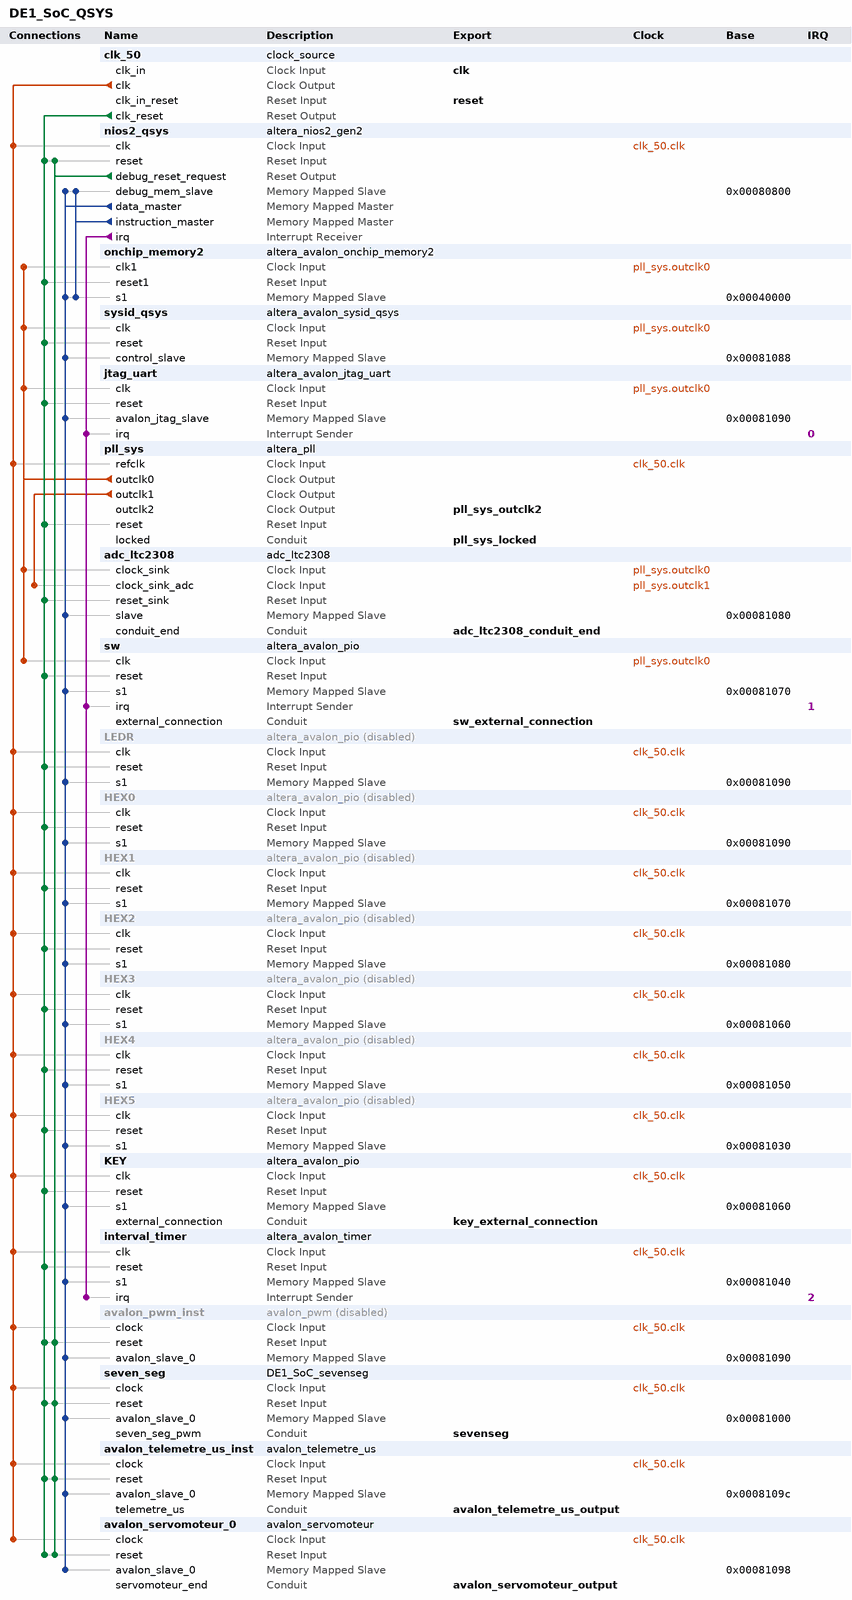
[diagram p0: system contents]
# Platform Designer (Qsys) system DE1_SoC_QSYS, Cyclone V 5CSEMA5F31C6
# Parameters at their usual value, and those the tool derives, are not listed.
package require -exact qsys 18.1
create_system DE1_SoC_QSYS
set_project_property DEVICE_FAMILY {Cyclone V}
set_project_property DEVICE 5CSEMA5F31C6

add_instance clk_50 clock_source 18.1
set_instance_parameter_value clk_50 clockFrequency 50000000

add_instance nios2_qsys altera_nios2_gen2 18.1
set_instance_parameter_value nios2_qsys dcache_size 2048
set_instance_parameter_value nios2_qsys exceptionSlave onchip_memory2.s1
set_instance_parameter_value nios2_qsys icache_size 4096
set_instance_parameter_value nios2_qsys impl Fast
set_instance_parameter_value nios2_qsys resetSlave onchip_memory2.s1
set_instance_parameter_value nios2_qsys setting_activateTrace true

add_instance onchip_memory2 altera_avalon_onchip_memory2 18.1
set_instance_parameter_value onchip_memory2 dataWidth 32
set_instance_parameter_value onchip_memory2 dualPort false
set_instance_parameter_value onchip_memory2 initMemContent true
set_instance_parameter_value onchip_memory2 initializationFileName onchip_mem.hex
set_instance_parameter_value onchip_memory2 memorySize 160000

add_instance sysid_qsys altera_avalon_sysid_qsys 18.1
set_instance_parameter_value sysid_qsys id 0

add_instance jtag_uart altera_avalon_jtag_uart 18.1
set_instance_parameter_value jtag_uart simInteractiveOptions NO_INTERACTIVE_WINDOWS

add_instance pll_sys altera_pll 18.1
set_instance_parameter_value pll_sys gui_device_speed_grade 2
set_instance_parameter_value pll_sys gui_number_of_clocks 3
set_instance_parameter_value pll_sys gui_operation_mode normal
set_instance_parameter_value pll_sys gui_output_clock_frequency0 100.0
set_instance_parameter_value pll_sys gui_output_clock_frequency1 40.0
set_instance_parameter_value pll_sys gui_output_clock_frequency2 200.0
set_instance_parameter_value pll_sys gui_pll_mode {Integer-N PLL}
set_instance_parameter_value pll_sys gui_reference_clock_frequency 50.0
set_instance_parameter_value pll_sys gui_use_locked true

add_instance adc_ltc2308 adc_ltc2308 1.1

add_instance sw altera_avalon_pio 18.1
set_instance_parameter_value sw captureEdge true
set_instance_parameter_value sw direction Input
set_instance_parameter_value sw edgeType ANY
set_instance_parameter_value sw generateIRQ true
set_instance_parameter_value sw irqType EDGE
set_instance_parameter_value sw width 10

add_instance LEDR altera_avalon_pio 18.1
set_instance_property LEDR ENABLED false
set_instance_parameter_value LEDR direction Output
set_instance_parameter_value LEDR width 10

add_instance HEX0 altera_avalon_pio 18.1
set_instance_property HEX0 ENABLED false
set_instance_parameter_value HEX0 direction Output
set_instance_parameter_value HEX0 width 7

add_instance HEX1 altera_avalon_pio 18.1
set_instance_property HEX1 ENABLED false
set_instance_parameter_value HEX1 direction Output
set_instance_parameter_value HEX1 width 7

add_instance HEX2 altera_avalon_pio 18.1
set_instance_property HEX2 ENABLED false
set_instance_parameter_value HEX2 direction Output
set_instance_parameter_value HEX2 width 7

add_instance HEX3 altera_avalon_pio 18.1
set_instance_property HEX3 ENABLED false
set_instance_parameter_value HEX3 direction Output
set_instance_parameter_value HEX3 width 7

add_instance HEX4 altera_avalon_pio 18.1
set_instance_property HEX4 ENABLED false
set_instance_parameter_value HEX4 direction Output
set_instance_parameter_value HEX4 width 7

add_instance HEX5 altera_avalon_pio 18.1
set_instance_property HEX5 ENABLED false
set_instance_parameter_value HEX5 direction Output
set_instance_parameter_value HEX5 width 7

add_instance KEY altera_avalon_pio 18.1
set_instance_parameter_value KEY direction Input
set_instance_parameter_value KEY width 4

add_instance interval_timer altera_avalon_timer 18.1
set_instance_parameter_value interval_timer period 1
set_instance_parameter_value interval_timer periodUnits MSEC

add_instance avalon_pwm_inst avalon_pwm 1.0
set_instance_property avalon_pwm_inst ENABLED false

add_instance seven_seg DE1_SoC_sevenseg 1.0

add_instance avalon_telemetre_us_inst avalon_telemetre_us 1.0

add_instance avalon_servomoteur_0 avalon_servomoteur 1.0

# connections
add_connection clk_50.clk avalon_pwm_inst.clock clock
add_connection clk_50.clk avalon_servomoteur_0.clock clock
add_connection clk_50.clk avalon_telemetre_us_inst.clock clock
add_connection clk_50.clk HEX0.clk clock
add_connection clk_50.clk HEX1.clk clock
add_connection clk_50.clk HEX2.clk clock
add_connection clk_50.clk HEX3.clk clock
add_connection clk_50.clk HEX4.clk clock
add_connection clk_50.clk HEX5.clk clock
add_connection clk_50.clk interval_timer.clk clock
add_connection clk_50.clk KEY.clk clock
add_connection clk_50.clk LEDR.clk clock
add_connection clk_50.clk nios2_qsys.clk clock
add_connection clk_50.clk pll_sys.refclk clock
add_connection clk_50.clk seven_seg.clock clock
add_connection pll_sys.outclk0 adc_ltc2308.clock_sink clock
add_connection pll_sys.outclk0 jtag_uart.clk clock
add_connection pll_sys.outclk0 onchip_memory2.clk1 clock
add_connection pll_sys.outclk0 sw.clk clock
add_connection pll_sys.outclk0 sysid_qsys.clk clock
add_connection pll_sys.outclk1 adc_ltc2308.clock_sink_adc clock
add_connection clk_50.clk_reset adc_ltc2308.reset_sink reset
add_connection clk_50.clk_reset avalon_pwm_inst.reset reset
add_connection clk_50.clk_reset avalon_servomoteur_0.reset reset
add_connection clk_50.clk_reset avalon_telemetre_us_inst.reset reset
add_connection clk_50.clk_reset HEX0.reset reset
add_connection clk_50.clk_reset HEX1.reset reset
add_connection clk_50.clk_reset HEX2.reset reset
add_connection clk_50.clk_reset HEX3.reset reset
add_connection clk_50.clk_reset HEX4.reset reset
add_connection clk_50.clk_reset HEX5.reset reset
add_connection clk_50.clk_reset interval_timer.reset reset
add_connection clk_50.clk_reset jtag_uart.reset reset
add_connection clk_50.clk_reset KEY.reset reset
add_connection clk_50.clk_reset LEDR.reset reset
add_connection clk_50.clk_reset nios2_qsys.reset reset
add_connection clk_50.clk_reset onchip_memory2.reset1 reset
add_connection clk_50.clk_reset pll_sys.reset reset
add_connection clk_50.clk_reset seven_seg.reset reset
add_connection clk_50.clk_reset sw.reset reset
add_connection clk_50.clk_reset sysid_qsys.reset reset
add_connection nios2_qsys.debug_reset_request avalon_pwm_inst.reset reset
add_connection nios2_qsys.debug_reset_request avalon_servomoteur_0.reset reset
add_connection nios2_qsys.debug_reset_request avalon_telemetre_us_inst.reset reset
add_connection nios2_qsys.debug_reset_request nios2_qsys.reset reset
add_connection nios2_qsys.debug_reset_request seven_seg.reset reset
add_connection nios2_qsys.data_master adc_ltc2308.slave avalon
set_connection_parameter_value nios2_qsys.data_master/adc_ltc2308.slave baseAddress 0x00081080
add_connection nios2_qsys.data_master avalon_pwm_inst.avalon_slave_0 avalon
set_connection_parameter_value nios2_qsys.data_master/avalon_pwm_inst.avalon_slave_0 baseAddress 0x00081090
add_connection nios2_qsys.data_master avalon_servomoteur_0.avalon_slave_0 avalon
set_connection_parameter_value nios2_qsys.data_master/avalon_servomoteur_0.avalon_slave_0 baseAddress 0x00081098
add_connection nios2_qsys.data_master avalon_telemetre_us_inst.avalon_slave_0 avalon
set_connection_parameter_value nios2_qsys.data_master/avalon_telemetre_us_inst.avalon_slave_0 baseAddress 0x0008109c
add_connection nios2_qsys.data_master HEX0.s1 avalon
set_connection_parameter_value nios2_qsys.data_master/HEX0.s1 baseAddress 0x00081090
add_connection nios2_qsys.data_master HEX1.s1 avalon
set_connection_parameter_value nios2_qsys.data_master/HEX1.s1 baseAddress 0x00081070
add_connection nios2_qsys.data_master HEX2.s1 avalon
set_connection_parameter_value nios2_qsys.data_master/HEX2.s1 baseAddress 0x00081080
add_connection nios2_qsys.data_master HEX3.s1 avalon
set_connection_parameter_value nios2_qsys.data_master/HEX3.s1 baseAddress 0x00081060
add_connection nios2_qsys.data_master HEX4.s1 avalon
set_connection_parameter_value nios2_qsys.data_master/HEX4.s1 baseAddress 0x00081050
add_connection nios2_qsys.data_master HEX5.s1 avalon
set_connection_parameter_value nios2_qsys.data_master/HEX5.s1 baseAddress 0x00081030
add_connection nios2_qsys.data_master interval_timer.s1 avalon
set_connection_parameter_value nios2_qsys.data_master/interval_timer.s1 baseAddress 0x00081040
add_connection nios2_qsys.data_master jtag_uart.avalon_jtag_slave avalon
set_connection_parameter_value nios2_qsys.data_master/jtag_uart.avalon_jtag_slave baseAddress 0x00081090
add_connection nios2_qsys.data_master KEY.s1 avalon
set_connection_parameter_value nios2_qsys.data_master/KEY.s1 baseAddress 0x00081060
add_connection nios2_qsys.data_master LEDR.s1 avalon
set_connection_parameter_value nios2_qsys.data_master/LEDR.s1 baseAddress 0x00081090
add_connection nios2_qsys.data_master nios2_qsys.debug_mem_slave avalon
set_connection_parameter_value nios2_qsys.data_master/nios2_qsys.debug_mem_slave baseAddress 0x00080800
add_connection nios2_qsys.data_master onchip_memory2.s1 avalon
set_connection_parameter_value nios2_qsys.data_master/onchip_memory2.s1 baseAddress 0x00040000
add_connection nios2_qsys.data_master seven_seg.avalon_slave_0 avalon
set_connection_parameter_value nios2_qsys.data_master/seven_seg.avalon_slave_0 baseAddress 0x00081000
add_connection nios2_qsys.data_master sw.s1 avalon
set_connection_parameter_value nios2_qsys.data_master/sw.s1 baseAddress 0x00081070
add_connection nios2_qsys.data_master sysid_qsys.control_slave avalon
set_connection_parameter_value nios2_qsys.data_master/sysid_qsys.control_slave baseAddress 0x00081088
add_connection nios2_qsys.instruction_master nios2_qsys.debug_mem_slave avalon
set_connection_parameter_value nios2_qsys.instruction_master/nios2_qsys.debug_mem_slave baseAddress 0x00080800
add_connection nios2_qsys.instruction_master onchip_memory2.s1 avalon
set_connection_parameter_value nios2_qsys.instruction_master/onchip_memory2.s1 baseAddress 0x00040000
add_connection nios2_qsys.irq interval_timer.irq interrupt
set_connection_parameter_value nios2_qsys.irq/interval_timer.irq irqNumber 2
add_connection nios2_qsys.irq jtag_uart.irq interrupt
set_connection_parameter_value nios2_qsys.irq/jtag_uart.irq irqNumber 0
add_connection nios2_qsys.irq sw.irq interrupt
set_connection_parameter_value nios2_qsys.irq/sw.irq irqNumber 1

# exported interfaces
add_interface adc_ltc2308_conduit_end conduit end
set_interface_property adc_ltc2308_conduit_end EXPORT_OF adc_ltc2308.conduit_end
add_interface avalon_servomoteur_output conduit end
set_interface_property avalon_servomoteur_output EXPORT_OF avalon_servomoteur_0.servomoteur_end
add_interface avalon_telemetre_us_output conduit end
set_interface_property avalon_telemetre_us_output EXPORT_OF avalon_telemetre_us_inst.telemetre_us
add_interface clk clock sink
set_interface_property clk EXPORT_OF clk_50.clk_in
add_interface key_external_connection conduit end
set_interface_property key_external_connection EXPORT_OF KEY.external_connection
add_interface pll_sys_locked conduit end
set_interface_property pll_sys_locked EXPORT_OF pll_sys.locked
add_interface pll_sys_outclk2 clock source
set_interface_property pll_sys_outclk2 EXPORT_OF pll_sys.outclk2
add_interface reset reset sink
set_interface_property reset EXPORT_OF clk_50.clk_in_reset
add_interface sevenseg conduit end
set_interface_property sevenseg EXPORT_OF seven_seg.seven_seg_pwm
add_interface sw_external_connection conduit end
set_interface_property sw_external_connection EXPORT_OF sw.external_connection

set_interconnect_requirement {$system} qsys_mm.clockCrossingAdapter HANDSHAKE
set_interconnect_requirement {$system} qsys_mm.maxAdditionalLatency 1

save_system DE1_SoC_QSYS.qsys
